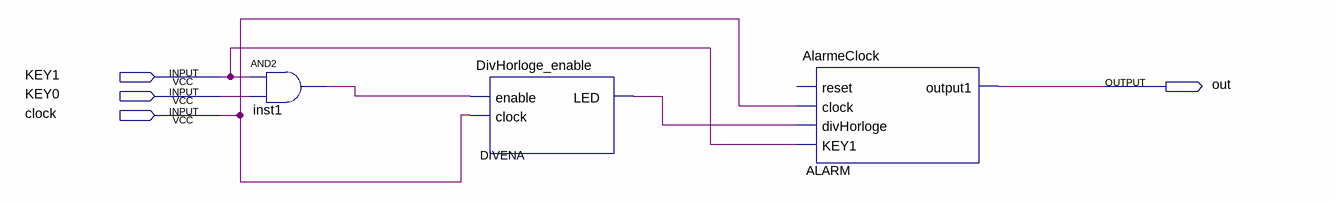
[diagram p0: schematic sheet]
// Quartus schematic Alarme.bdf as structural Verilog: 3 symbols, 4 pins
module Alarme (
  input  KEY1,
  input  KEY0,
  input  clock,
  output out
);

  wire DIVENA_led, inst1_out;

  and inst1 (inst1_out, KEY1, KEY0);
  DivHorloge_enable DIVENA (.enable(inst1_out), .clock(clock), .LED(DIVENA_led));
  AlarmeClock ALARM (.clock(clock), .divHorloge(DIVENA_led), .KEY1(KEY1), .output1(out));  // open: reset
endmodule
